# EAGLE design Me-Limit Switch v2.0 (EAGLE 6.2)
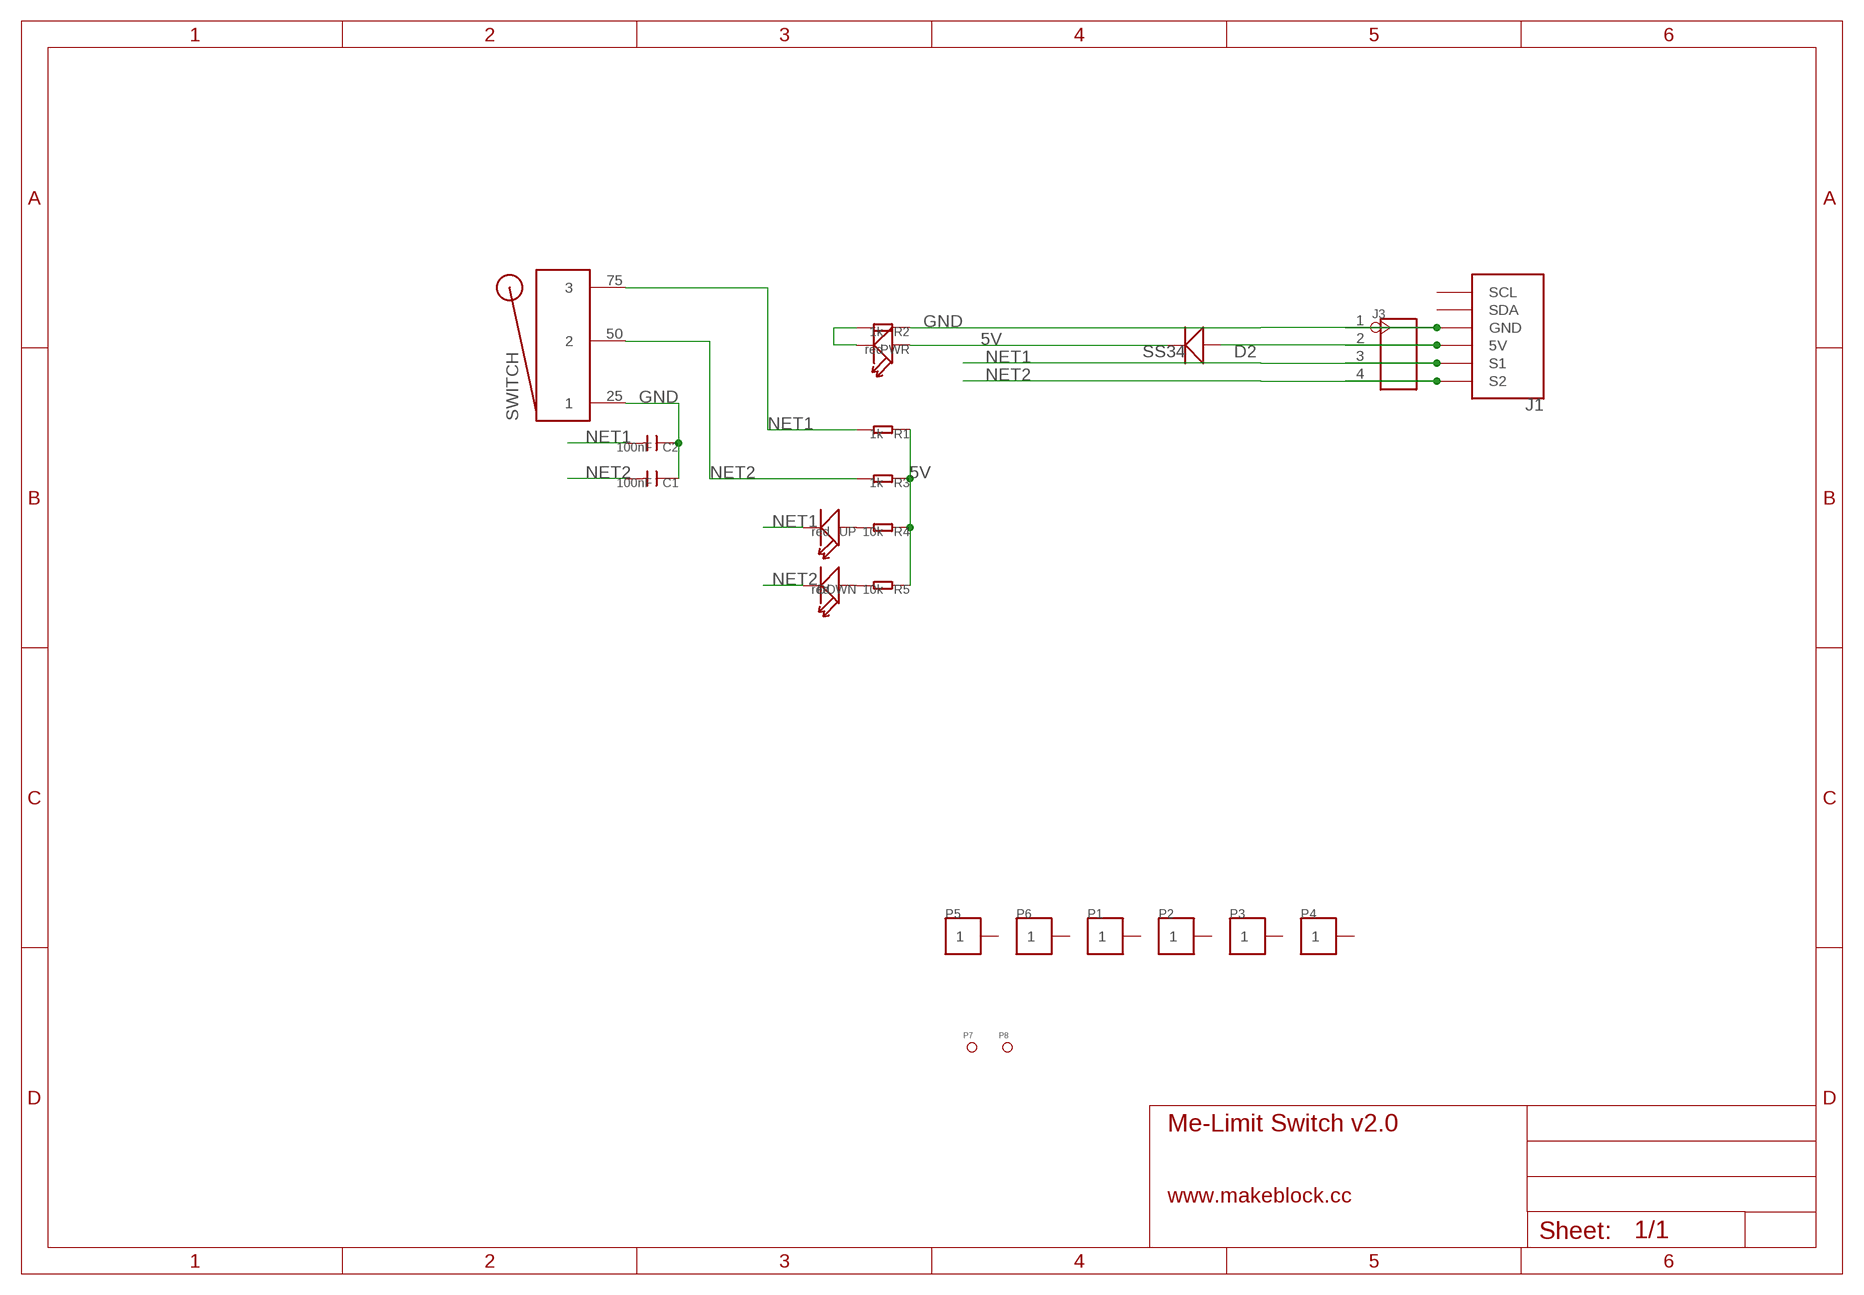
[diagram p0: schematic, sheet 1]

## Parts
C1  100nF  C-0603  [0603]
C2  100nF  C-0603  [0603]
D2  SS34  D'SMA'  [D2010]
DOWN  red  LED'0603'  [LED-0603]
J1  RJ11-6P6C-DIGI  [RJ11-6P6C]
J3  HEADER-4P-60/35MIL  [4P-65/35MIL]
P1  PAD-1P-4MM  [HOLE-01]
P2  PAD-1P-4MM  [HOLE-01]
P3  PAD-1P-4MM  [HOLE-01]
P4  PAD-1P-4MM  [HOLE-01]
P5  PAD-1P-4MM  [HOLE-01]
P6  PAD-1P-4MM  [HOLE-01]
P7  PAD-MARK  [ROUND-MARK-1.0]
P8  PAD-MARK  [ROUND-MARK-1.0]
PWR  red  LED'0603'  [LED-0603]
R1  1k  R-0603  [0603]
R2  1k  R-0603  [0603]
R3  1k  R-0603  [0603]
R4  10k  R-0603  [0603]
R5  10k  R-0603  [0603]
SWITCH  OMRON-SS5GL2  [OMRON-SS5GL2]
UP  red  LED'0603'  [LED-0603]

## Nets
5V: D2.- PWR.+ R1.1 R3.1 R4.1 R5.1
GND: C1.1 C2.1 J1.3(GND) J3.1 R2.1 SWITCH.25
N$1: PWR.- R2.2
N$2: DOWN.+ R5.2
N$3: R4.2 UP.+
N$4: D2.+ J1.4(5V) J3.2
NET1: C2.2 J1.5(S1) J3.3 R1.2 SWITCH.75 UP.-
NET2: C1.2 DOWN.- J1.6(S2) J3.4 R3.2 SWITCH.50
Unconnected: J1.1(SCL) J1.2(SDA) P1.1 P2.1 P3.1 P4.1 P5.1 P6.1

## Notes on the sheet
- www.makeblock.cc

## Library data of the parts
C1 C2 = Discrete:C*: Ceramic Capacitors
D2 = Discrete:D*
DOWN PWR UP = Discrete:LED*
J1 = Makeblock:RJ11-6P6C-DIGI
J3 = Connector:HEADER-4P
P1-P6 = Makeblock:PAD-1P*
P7 P8 = Discrete:PAD-MARK; PARTNO: DNP
R1-R5 = Discrete:R*
SWITCH = Makeblock:OMRON-SS5GL2

## Board
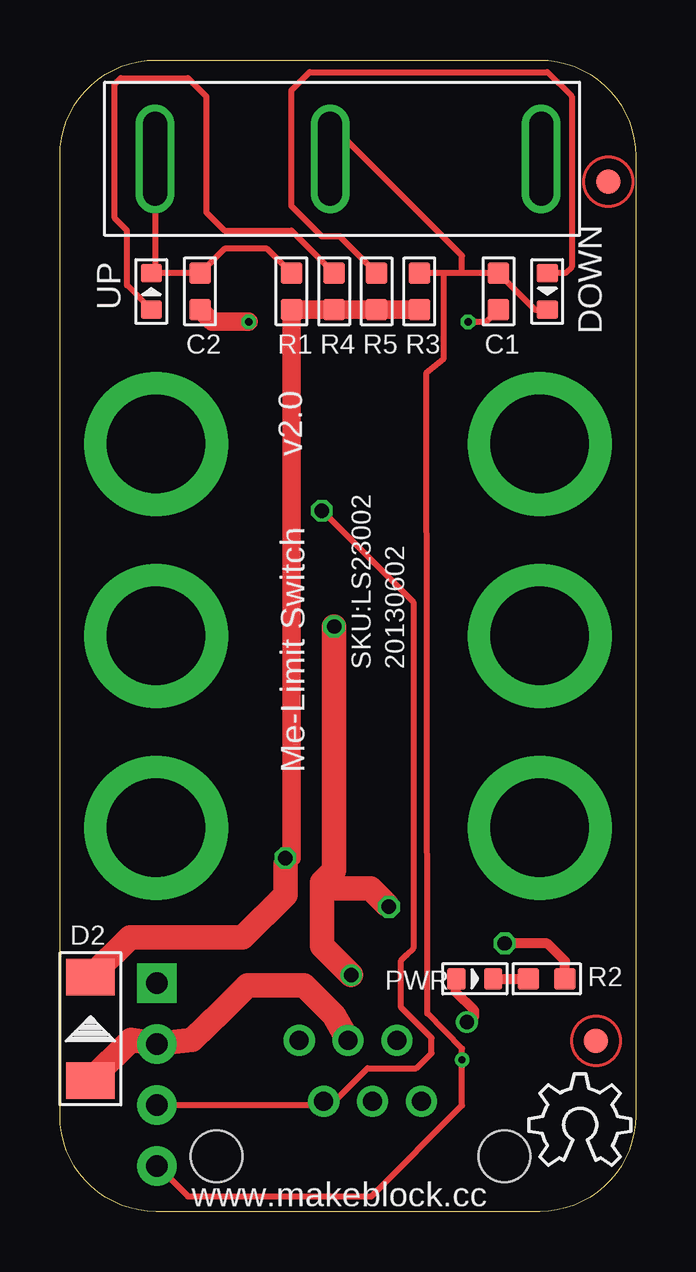
[diagram p1: board, top side]
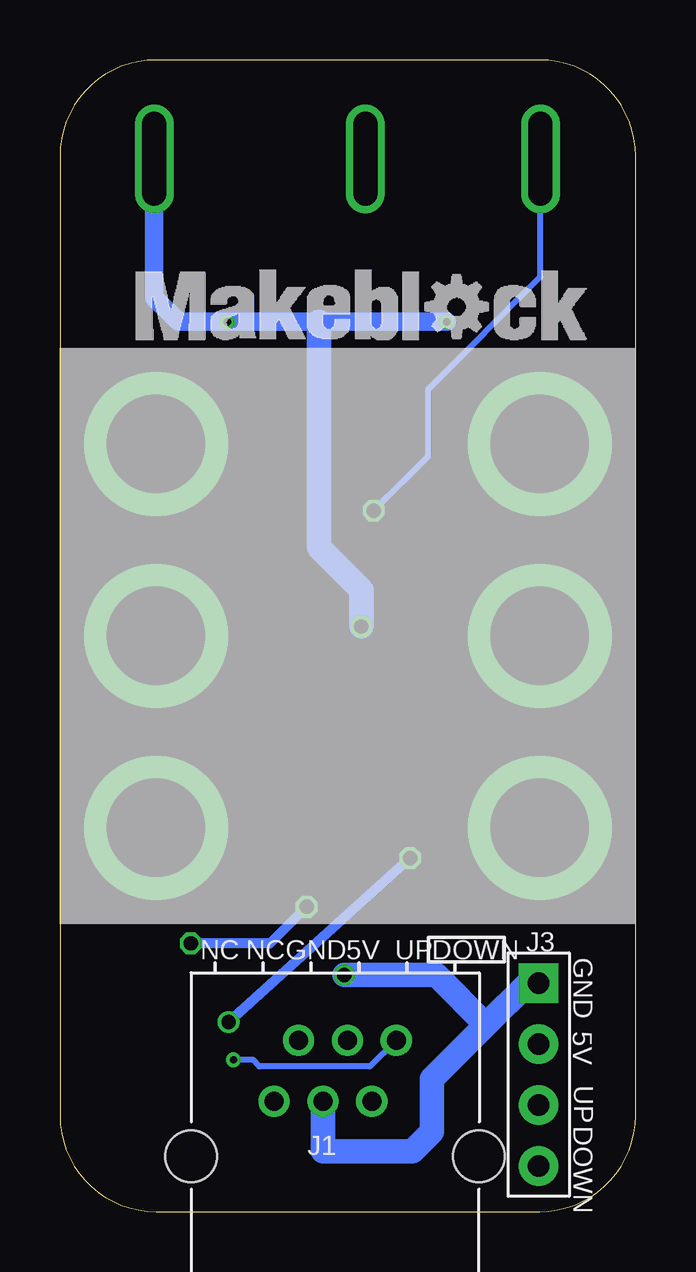
[diagram p2: board, bottom side, seen from below]

Size 24 x 48 mm. Coordinates in mm from the lower left corner, seen from the top.
Outline: 0,4 0,44 arc-90 4,48 20,48 arc-90 24,44 24,4 arc-90 20,0 4,0 arc-90 0,4
Copper layers (1*16): Top 0.035mm / dielectric 1.5mm / Bottom 0.035mm
Design rules: minimum track width 6mil, minimum drill 12mil, track to track 8mil, track to pad 8mil, pad to pad 8mil, via to via 8mil, smd to smd 0mil, copper to edge 10mil, drill to drill 10mil, minimum pad ring 10mil, minimum via ring 6mil, stop-mask expansion 2mil, vias tented up to drill 100mil, thermal gap 10mil

### Footprints (pad centres in the part's own frame; a part is rotated, then mirrored left to right if it is on the bottom)
0603 = smd 0.889 x 0.889: 1 -0.762,0; 2 0.762,0
D2010 = smd 1.524 x 2.032: + -2.159,0; - 2.159,0
LED-0603 = smd 0.762 x 0.889: + -0.762,0; - 0.762,0
RJ11-6P6C = drill 0.8: 1 -2.55,1.8; 2 -1.53,4.34; 3 -0.51,1.8; 4 0.51,4.34; 5 1.53,1.8; 6 2.55,4.34 | hole 2.15: -6,-0.5; 6,-0.5
4P-65/35MIL = drill 0.889 pad 1.651 square: 1 0,3.81 | drill 0.889 pad 1.651: 2 0,1.27; 3 0,-1.27; 4 0,-3.81
HOLE-01 = drill 4.1 pad 6: 1 0,0
ROUND-MARK-1.0 = smd 1.016 x 1.016: P$1 0,0
OMRON-SS5GL2 = drill 1 pad 1.6: 1 0,-0.127; 2 0,-0.254; 3 0,-0.381; 4 0,0; 5 0,-0.508; 6 0,-0.635; 7 0,-0.762; 8 0,-0.889; 9 0,-1.016; 10 0,-1.143; 11 0,-1.27; 12 0,-1.397; 13 0,-1.524; 14 0,-1.651; 15 0,-1.778; 16 0,-2.032; 17 0,-1.905; 18 0,-2.032; 19 0,-2.159; 20 0,-2.286; 21 0,-2.413; 22 0,-2.54; 23 0,-2.667; 24 0,-2.794; 25 0,-2.921; 26 8.8,0; 27 8.8,-0.127; 28 8.8,-0.254; 29 8.8,-0.381; 30 8.8,-0.508; 31 8.8,-0.635; 32 8.8,-0.762; 33 8.8,-0.889; 34 8.8,-1.016; 35 8.8,-1.143; 36 8.8,-1.27; 37 8.8,-1.397; 38 8.8,-1.524; 39 8.8,-1.651; 40 8.8,-1.778; 41 8.8,-2.032; 42 8.8,-1.905; 43 8.8,-2.032; 44 8.8,-2.159; 45 8.8,-2.286; 46 8.8,-2.413; 47 8.8,-2.54; 48 8.8,-2.667; 49 8.8,-2.794; 50 8.8,-2.921; 51 16.1,0; 52 16.1,-0.127; 53 16.1,-0.254; 54 16.1,-0.381; 55 16.1,-0.508; 56 16.1,-0.635; 57 16.1,-0.762; 58 16.1,-0.889; 59 16.1,-1.016; 60 16.1,-1.143; 61 16.1,-1.27; 62 16.1,-1.397; 63 16.1,-1.524; 64 16.1,-1.651; 65 16.1,-1.778; 66 16.1,-2.032; 67 16.1,-1.905; 68 16.1,-2.032; 69 16.1,-2.159; 70 16.1,-2.286; 71 16.1,-2.413; 72 16.1,-2.54; 73 16.1,-2.667; 74 16.1,-2.794; 75 16.1,-2.921

### Placement (x,y rotation side)
C1  18.29,38.35 90 top
C2  5.84,38.35 90 top
D2  1.27,7.62 90 top
DOWN  20.32,38.35 270 top
J1  12.52,2.79 0 bottom
J3  4.04,5.71 0 bottom
P1  4,32 0 top
P2  20,32 0 top
P3  4,16 0 top
P4  20,16 0 top
P5  20,24 0 top
P6  4,24 0 top
P7  22.86,42.93 0 top
P8  22.35,7.11 0 top
PWR  17.3,9.7 0 top
R1  9.65,38.35 90 top
R2  20.29,9.7 180 top
R3  14.99,38.35 90 top
R4  11.43,38.35 90 top
R5  13.21,38.35 90 top
SWITCH  20.07,42.42 180 top
U$1  [LOGO-3/2]  20.85,36.32 0 bottom
U$2  [OSHW_6X150_NOTEXT]  19.56,1.93 0 top
UP  3.81,38.35 90 top

### Tracks (layer width: path | path; a pad name or v marks a point on that pad's centre or on a via)
5V  (via drill 0.6)
  Top 0.406: v16.97,7.9 17.02,7.87 17.27,8.13 17.27,8.38 16.51,9.14 16.51,9.68 PWR.+
  Top 0.508: 9.65,14.73 v9.4,14.73
  Top 0.762: R1.1 R3.1 R5.1 | R4.1 R1.1 | 9.4,14.48 9.65,14.73 R1.1
  Top 1.016: D2.- 2.92,11.43 7.62,11.43 9.4,13.21 9.4,14.48
  Bottom 0.406: v9.4,14.73 v16.97,7.9
GND  (via drill 0.3 pad 0.61, 0.6)
  Top 0.254: v17.02,37.08 17.78,37.08 C1.1
  Top 0.406: R2.1 21.06,10.44 20.32,11.18 v18.54,11.18
  Top 0.508: v13.72,12.7 13.62,12.79
  Top 0.762: v7.87,37.08 6.35,37.08 C2.1
  Top 1.016: v11.43,24.38 11.43,14.22 10.92,13.72 10.92,13.46 | 10.92,13.46 10.92,11.43 10.92,11.07 v12.14,9.86 | 13.62,12.79 12.95,13.46 10.92,13.46
  Bottom 0.406: v13.72,12.7 15.24,11.18 v18.54,11.18
  Bottom 0.762: SWITCH.25 20.07,38.1 19.05,37.08 v17.02,37.08 13.21,37.08 v7.87,37.08
  Bottom 1.016: v11.43,24.38 11.43,25.91 13.21,27.69 13.21,37.08 | J1.3 13.03,2.52 10.54,2.52 9.3,2.52 8.48,3.33 8.48,5.53 6.23,7.78 | v12.14,9.86 8.31,9.86 6.23,7.78 | J3.1 4.5,9.52 6.23,7.78
N$1
  Top 0.406: PWR.- R2.2
N$2
  Top 0.254: R5.2 11.68,40.64 10.92,40.64 9.65,41.91 9.65,46.74 10.41,47.5 20.32,47.5 21.34,46.48 21.34,39.37 21.08,39.12 DOWN.+
N$3
  Top 0.254: UP.+ 2.79,38.61 2.79,40.89 2.29,41.4 2.29,46.99 2.54,47.24 5.33,47.24 6.1,46.48 6.1,41.66 6.86,40.89 9.65,40.89 R4.2
N$4
  Top 1.016: D2.+ 2.97,7.16 J3.2 5.52,7.16 6.76,8.36 7.82,9.42 10.19,9.42 11.43,8.18 J1.4
NET1  (via drill 0.6)
  Top 0.254: SWITCH.75 3.97,39.27 UP.- C2.2 6.86,40.13 8.64,40.13 R1.2 | v10.92,29.21 14.73,25.4 14.73,10.97 14.45,10.69 14.22,10.46 14.22,8.51 14.86,7.87 15.49,7.24 15.49,6.6 14.86,5.97 12.83,5.97 11.45,4.59 J1.5 10.33,4.44 J3.3
  Bottom 0.254: v10.92,29.21 8.64,31.5 8.64,34.29 3.97,38.96 SWITCH.75
NET2  (via drill 0.3 pad 0.61)
  Top 0.254: 16.76,39.12 16,39.12 | 16,39.12 R3.2 | 16.76,39.12 16.76,39.84 SWITCH.50 | 16.76,39.12 C1.2 19.81,37.59 DOWN.- | J3.4 4.07,1.9 5.33,0.64 12.98,0.64 16.76,4.42 v16.76,6.33 16.76,6.78 15.32,8.26 15.29,34.98 16,35.56 16,39.12
  Bottom 0.254: 16.66,6.33 15.95,6.33 15.7,6.04 11.07,6.04 10,7.12 J1.6 | 16.66,6.33 16.76,6.22 | 16.66,6.33 v16.76,6.33

### Text on the board
tPlace: v2.0 | SKU:LS23002 | 20130602 | Me-Limit Switch | www.makeblock.cc
bPlace: GND | DOWN | UP | 5V | GND | NC | NC | 5V | UP | DOWN